# EAGLE design G826X (EAGLE 6.6.0)
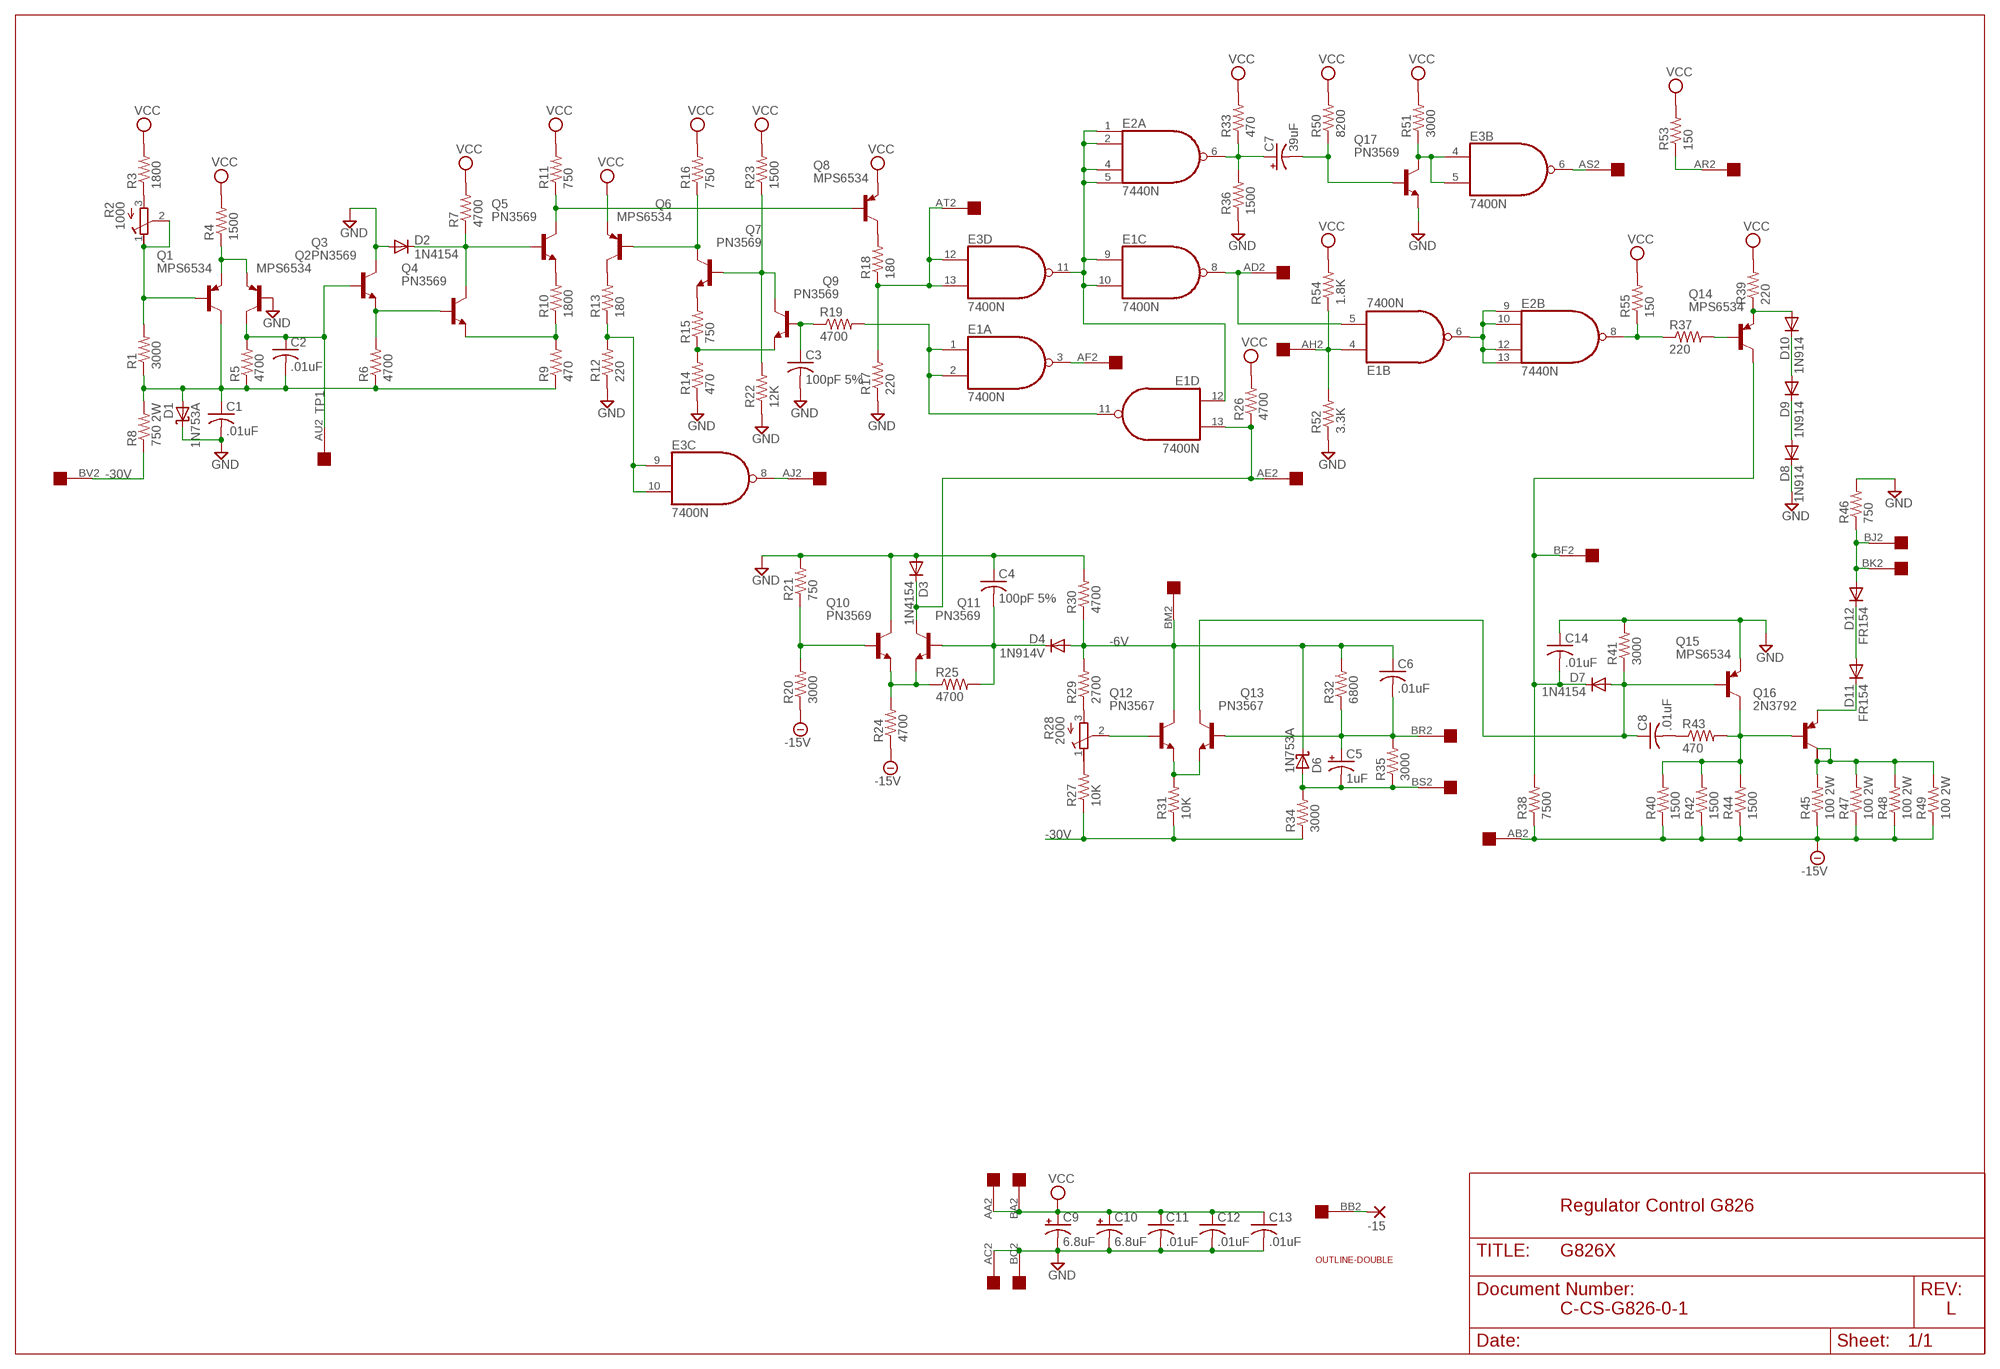
[diagram p0: schematic, sheet 1]

## Parts
-15  1,6/0,8  [1,6/0,8]
C1  .01uF  C-US050-025X075  [C050-025X075]
C2  .01uF  C-US050-025X075  [C050-025X075]
C3  100pF 5%  C-US050-025X075  [C050-025X075]
C4  100pF 5%  C-US050-025X075  [C050-025X075]
C5  1uF  CPOL-USE15-5AXIAL  [E15-5]
C6  .01uF  C-US050-025X075  [C050-025X075]
C7  39uF  CPOL-USE22-6AXIAL  [E22-6]
C8  .01uF  C-US050-025X075  [C050-025X075]
C9  6.8uF  CPOL-USE20-8AXIAL  [E12-8]
C10  6.8uF  CPOL-USE20-8AXIAL  [E12-8]
C11  .01uF  C-US050-025X075  [C050-025X075]
C12  .01uF  C-US050-025X075  [C050-025X075]
C13  .01uF  C-US050-025X075  [C050-025X075]
C14  .01uF  C-US050-025X075  [C050-025X075]
D1  1N753A  BAT42  [DO35-10]
D2  1N4154  1N4148  [DO35-10]
D3  1N4154  1N4148  [DO35-10]
D4  1N914V  1N4148  [DO35-10]
D6  1N753A  BAT42  [DO35-10]
D7  1N4154  1N4148  [DO35-10]
D8  1N914  1N4148  [DO35-10]
D9  1N914  1N4148  [DO35-10]
D10  1N914  1N4148  [DO35-10]
D11  FR154  1N4004  [DO41-10]
D12  FR154  1N4004  [DO41-10]
E1  7400N  [DIL14]
E2  7440N  74S20N  [DIL14]
E3  7400N  [DIL14]
Q1  MPS6534  2N2904  [TO39]
Q2  MPS6534  2N2904  [TO39]
Q3  PN3569  2N2219  [TO5]
Q4  PN3569  2N2219  [TO5]
Q5  PN3569  2N2219  [TO5]
Q6  MPS6534  2N2904  [TO39]
Q7  PN3569  2N2219  [TO5]
Q8  MPS6534  2N2904  [TO39]
Q9  PN3569  2N2219  [TO5]
Q10  PN3569  2N2219  [TO5]
Q11  PN3569  2N2219  [TO5]
Q12  PN3567  2N2219  [TO5]
Q13  PN3567  2N2219  [TO5]
Q14  MPS6534  2N2904  [TO39]
Q15  MPS6534  2N2904  [TO39]
Q16  2N3792  2N4902  [TO3]
Q17  PN3569  2N2219  [TO5]
R1  3000  R-US_0207/10  [0207/10]
R2  1000  275P  [3006Y]
R3  1800  R-US_0207/10  [0207/10]
R4  1500  R-US_0207/10  [0207/10]
R5  4700  R-US_0207/10  [0207/10]
R6  4700  R-US_0207/10  [0207/10]
R7  4700  R-US_0207/10  [0207/10]
R8  750 2W  R-US_0818/25  [0818/25]
R9  470  R-US_0207/10  [0207/10]
R10  1800  R-US_0207/10  [0207/10]
R11  750  R-US_0207/10  [0207/10]
R12  220  R-US_0207/10  [0207/10]
R13  180  R-US_0207/10  [0207/10]
R14  470  R-US_0207/10  [0207/10]
R15  750  R-US_0207/10  [0207/10]
R16  750  R-US_0207/10  [0207/10]
R17  220  R-US_0207/10  [0207/10]
R18  180  R-US_0207/10  [0207/10]
R19  4700  R-US_0207/10  [0207/10]
R20  3000  R-US_0207/10  [0207/10]
R21  750  R-US_0207/10  [0207/10]
R22  12K  R-US_0207/10  [0207/10]
R23  1500  R-US_0207/10  [0207/10]
R24  4700  R-US_0207/10  [0207/10]
R25  4700  R-US_0207/10  [0207/10]
R26  4700  R-US_0207/10  [0207/10]
R27  10K  R-US_0207/10  [0207/10]
R28  2000  275P  [3006Y]
R29  2700  R-US_0207/10  [0207/10]
R30  4700  R-US_0207/10  [0207/10]
R31  10K  R-US_0207/10  [0207/10]
R32  6800  R-US_0207/10  [0207/10]
R33  470  R-US_0207/10  [0207/10]
R34  3000  R-US_0207/10  [0207/10]
R35  3000  R-US_0207/10  [0207/10]
R36  1500  R-US_0207/10  [0207/10]
R37  220  R-US_0207/10  [0207/10]
R38  7500  R-US_0207/10  [0207/10]
R39  220  R-US_0207/10  [0207/10]
R40  1500  R-US_0207/10  [0207/10]
R41  3000  R-US_0207/10  [0207/10]
R42  1500  R-US_0207/10  [0207/10]
R43  470  R-US_0207/10  [0207/10]
R44  1500  R-US_0207/10  [0207/10]
R45  100 2W  R-US_0818/25  [0818/25]
R46  750  R-US_0207/10  [0207/10]
R47  100 2W  R-US_0818/25  [0818/25]
R48  100 2W  R-US_0818/25  [0818/25]
R49  100 2W  R-US_0818/25  [0818/25]
R50  8200  R-US_0207/10  [0207/10]
R51  3000  R-US_0207/10  [0207/10]
R52  3.3K  R-US_0207/10  [0207/10]
R53  150  R-US_0207/10  [0207/10]
R54  1.8K  R-US_0207/10  [0207/10]
R55  150  R-US_0207/10  [0207/10]
U$1  DOUBLE  [EDGE-CON4]
U$2  OUTLINE-DOUBLE  [DOUBLE]

## Nets
-6V: C6.1 D4.A D6.C Q12.3(C) R29.2 R30.1 R32.2 U$1.BM2
-15V: R20.1 R24.1 R38.1 R40.1 R42.1 R44.1 R45.1 R47.1 R48.1 R49.1 U$1.AB2
-30V: R8.1 R27.1 R31.1 R34.1 U$1.BV2
GND: C1.2 C3.2 C4.1 C9.- C10.- C11.2 C12.2 C13.2 C14.1 D1.C D2.A D3.A D8.C Q2.2(B) Q3.3(C) Q10.3(C) Q15.1(E) Q17.1(E) R12.1 R14.1 R17.1 R21.2 R22.1 R30.2 R36.1 R41.2 R46.2 R52.1 U$1.AC2 U$1.BC2
N$1: Q1.2(B) R1.2 R2.1(A) R2.2(S)
N$2: R2.3(E) R3.1
N$3: C1.1 C2.2 D1.A Q1.3(C) R1.1 R5.1 R6.1 R8.2 R9.1
N$4: Q1.1(E) Q2.1(E) R4.1
N$5: Q3.1(E) Q4.2(B) R6.2
N$6: Q4.1(E) R9.2 R10.1
N$7: D2.C Q4.3(C) Q5.2(B) R7.1
N$8: Q5.3(C) Q8.2(B) R11.1
N$9: Q5.1(E) R10.2
N$10: E3.9(C:I0) E3.10(C:I1) R12.2 R13.1
N$11: Q6.3(C) R13.2
N$12: E3.8(C:O) U$1.AJ2
N$13: Q6.2(B) Q7.3(C) R16.1
N$14: Q7.1(E) R15.2
N$15: Q9.1(E) R14.2 R15.1
N$16: Q7.2(B) Q9.3(C) R22.2 R23.1
N$17: Q8.3(C) R18.2
N$18: E3.12(D:I0) E3.13(D:I1) R17.2 R18.1 U$1.AT2
N$19: E1.9(C:I0) E1.10(C:I1) E1.12(D:I0) E2.1(A:I0) E2.2(A:I1) E2.4(A:I2) E2.5(A:I3) E3.11(D:O)
N$20: C3.1 Q9.2(B) R19.1
N$21: E1.1(A:I0) E1.2(A:I1) E1.11(D:O) R19.2
N$22: E1.3(A:O) U$1.AF2
N$23: E1.5(B:I1) E1.8(C:O) U$1.AD2
N$24: E1.6(B:O) E2.9(B:I0) E2.10(B:I1) E2.12(B:I2) E2.13(B:I3)
N$25: C7.+ E2.6(A:O) R33.1 R36.2
N$26: Q16.C Q16.C/ R45.2 R47.2 R48.2 R49.2
N$27: Q15.3(C) Q16.B R40.2 R42.2 R43.2 R44.2
N$28: C7.- Q17.2(B) R50.1
N$29: E3.4(B:I0) E3.5(B:I1) Q17.3(C) R51.1
N$30: E3.6(B:O) U$1.AS2
N$31: E1.4(B:I0) R52.2 R54.1 U$1.AH2
N$32: E2.8(B:O) R37.1 R55.1
N$33: R53.1 U$1.AR2
N$34: Q14.2(B) R37.2
N$35: D10.A Q14.1(E) R39.1
N$36: D8.A D9.C
N$37: D9.A D10.C
N$38: C14.2 D7.C Q14.3(C) R38.2 U$1.BF2
N$39: -15.1(P) U$1.BB2
N$40: Q10.2(B) R20.2 R21.1
N$41: Q10.1(E) Q11.1(E) R24.2 R25.1
N$42: D3.C E1.13(D:I1) Q11.3(C) R26.1 U$1.AE2
N$43: Q12.2(B) R28.2(S)
N$44: C4.2 D4.C Q11.2(B) R25.2
N$45: Q12.1(E) Q13.1(E) R31.2
N$46: C5.- D6.A R34.2 R35.1 U$1.BS2
N$47: R28.3(E) R29.1
N$48: R27.2 R28.1(A)
N$49: D11.C Q16.E
N$50: C5.+ C6.2 Q13.2(B) R32.1 R35.2 U$1.BR2
N$51: C8.1 D7.A Q13.3(C) Q15.2(B) R41.1
N$52: C8.2 R43.1
N$53: D11.A D12.C
N$54: D12.A R46.1 U$1.BJ2 U$1.BK2
TP1: C2.1 Q2.3(C) Q3.2(B) R5.2 U$1.AU2
VCC: C9.+ C10.+ C11.1 C12.1 C13.1 Q6.1(E) Q8.1(E) R3.2 R4.2 R7.2 R11.2 R16.2 R23.2 R26.2 R33.2 R39.2 R50.2 R51.2 R53.2 R54.2 R55.2 U$1.AA2 U$1.BA2
Unconnected: E3.1(A:I0) E3.2(A:I1) E3.3(A:O) U$1.AA1 U$1.AB1 U$1.AC1 U$1.AD1 U$1.AE1 U$1.AF1 U$1.AH1 U$1.AJ1 U$1.AK1 U$1.AK2 U$1.AL1 U$1.AL2 U$1.AM1 U$1.AM2 U$1.AN1 U$1.AN2 U$1.AP1 U$1.AP2 U$1.AR1 U$1.AS1 U$1.AT1 U$1.AU1 U$1.AV1 U$1.AV2 U$1.BA1 U$1.BB1 U$1.BC1 U$1.BD1 U$1.BD2 U$1.BE1 U$1.BE2 U$1.BF1 U$1.BH1 U$1.BH2 U$1.BJ1 U$1.BK1 U$1.BL1 U$1.BL2 U$1.BM1 U$1.BN1 U$1.BN2 U$1.BP1 U$1.BP2 U$1.BR1 U$1.BS1 U$1.BT1 U$1.BT2 U$1.BU1 U$1.BU2 U$1.BV1

## Notes on the sheet
- Regulator Control G826
- C-CS-G826-0-1 | L

## Power pins joined to a net without a drawn wire
GND: E1.7(P:GND) E2.7(P:GND) E3.7(P:GND)
VCC: E1.14(P:VCC) E2.14(P:VCC) E3.14(P:VCC)

## Library data of the parts
-15 = wirepad:1,6/0,8: THROUGH-HOLE PAD
C1-C4 C6 C8 C11-C14 = rcl:C-US: CAPACITOR, American symbol
C5 C7 = rcl:CPOL-US: POLARIZED CAPACITOR, American symbol
C9 C10 = dec-con:CPOL-USE20-8AXIAL: A 0.8 inch electrolytic.
D1 D6 = diode:BAT42: DIODE barrier diode
D2-D4 D7-D10 = diode:1N4148: DIODE high speed (Philips)
D11 D12 = diode:1N4004: DIODE general purpose rectifier, 1 A
E1 E3 = 74xx-us:74*00: Quad 2-input NAND gate
E2 = 74xx-us:74*20: Dual 4-input NAND gate
Q1 Q2 Q6 Q8 Q14 Q15 = transistor-pnp:2N2904*: PNP Transistror
Q3-Q5 Q7 Q9-Q13 Q17 = transistor-npn:2N2219: NPN Transistor
Q16 = transistor-pnp:2N4902: PNP Transistor
R1 R3-R7 R9-R27 R29-R44 R46 R50-R55 = rcl:R-US_: RESISTOR, American symbol
R2 R28 = dec-con:275P: Trimpot with 275P (3006Y) footprint.
R8 R45 R47-R49 = dec-con:R-US_0818/25: One inch resistor
U$1 = dec-con:DOUBLE: Double-Height DEC board
U$2 = dec-con:OUTLINE-*: Board outlines for DEC boards.

## Board
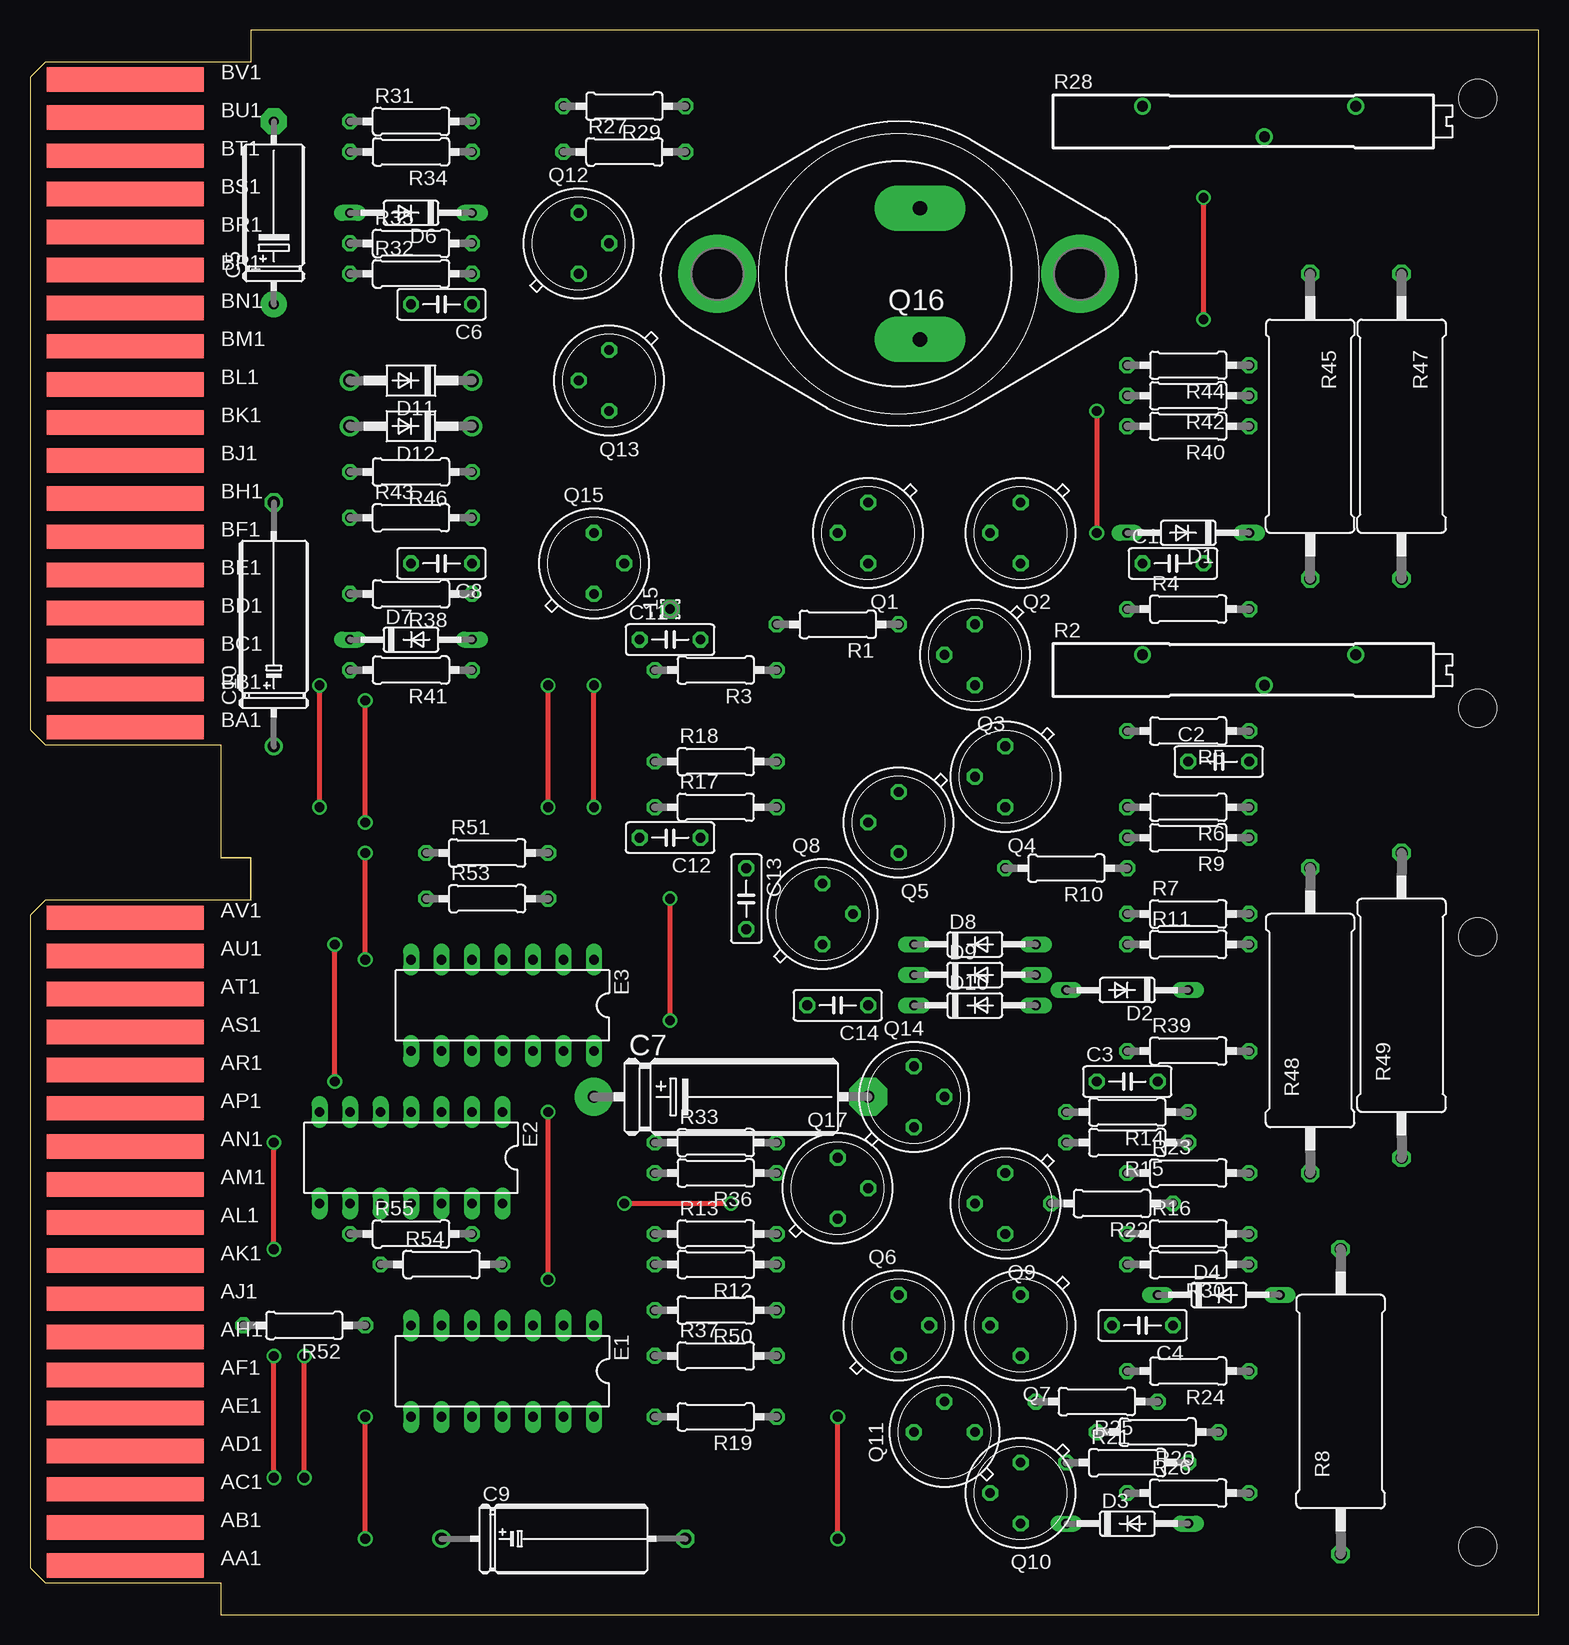
[diagram p1: board, top side]
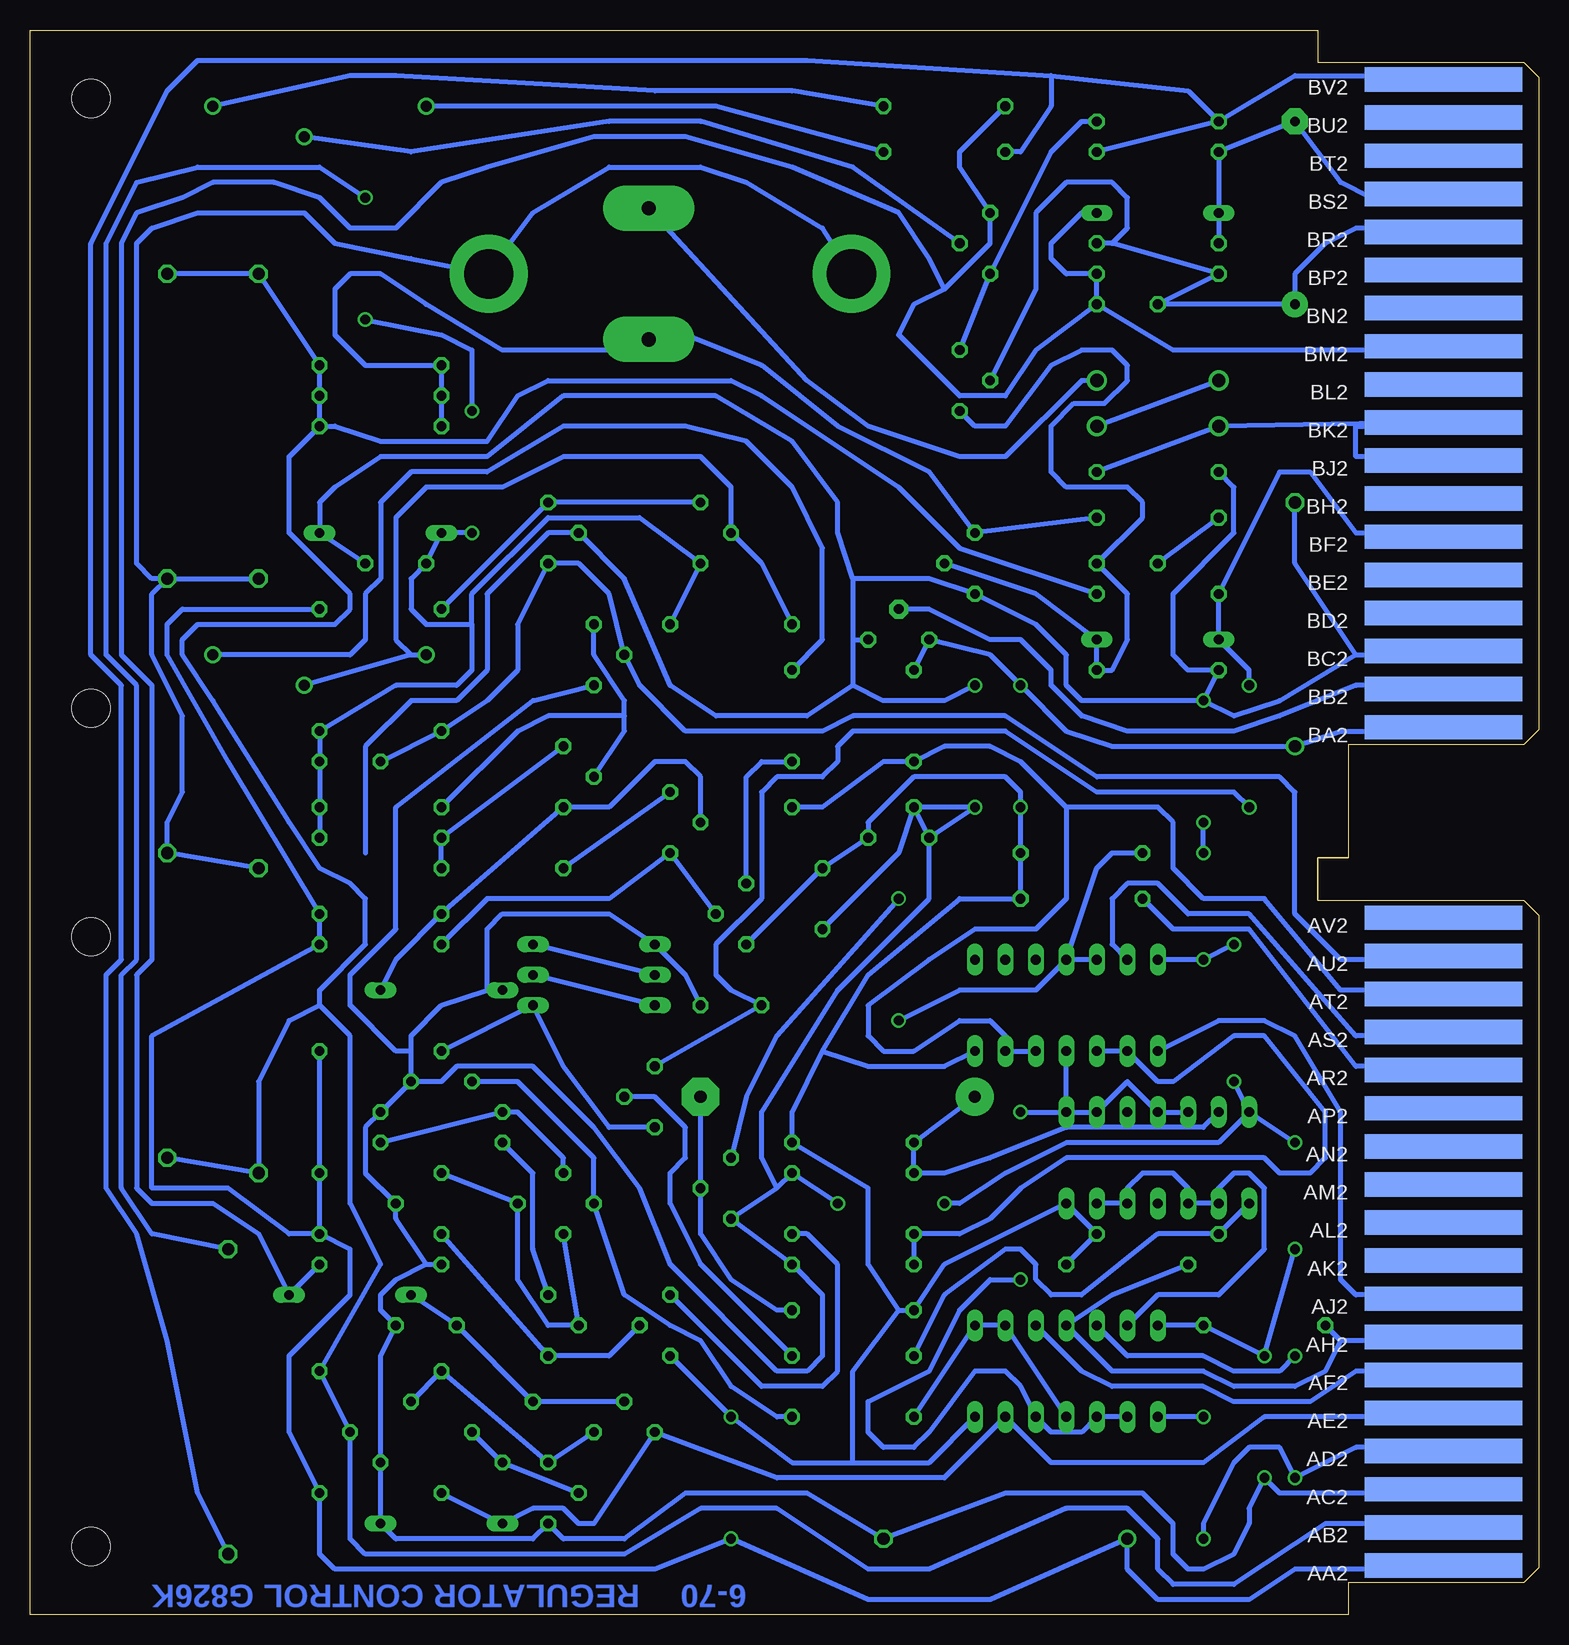
[diagram p2: board, bottom side, seen from below]

Size 125.73 x 132.08 mm. Coordinates in mm from the lower left corner, seen from the top.
Copper layers (1+16): Top 0.035mm / dielectric 1.5mm / Bottom 0.035mm
Design rules "16mils": minimum track width 16mil, minimum drill 32mil, track to track 15mil, track to pad 10mil, pad to pad 10mil, via to via 10mil, smd to smd 10mil, copper to edge 13mil, drill to drill 10mil, minimum pad ring 10mil, minimum via ring 8mil, stop-mask expansion 0mil, vias tented up to drill 0mil, thermal gap 10mil

### Footprints (pad centres in the part's own frame; a part is rotated, then mirrored left to right if it is on the bottom)
1,6/0,8 = drill 0.813 pad 1.6 octagon: 1 0,0
C050-025X075 = drill 0.813 octagon: 1 -2.54,0; 2 2.54,0
E15-5 = drill 0.813 pad 2.159: + -7.62,0 | drill 0.813 pad 2.159 octagon: - 7.62,0
E22-6 = drill 1.016 pad 3.15: + -11.43,0 | drill 1.016 pad 3.15 octagon: - 11.43,0
E12-8 = drill 1.016: + -10.16,0 | drill 1.016 octagon: - 10.16,0
DO35-10 = drill 0.813 long: A 5.08,0; C -5.08,0
DO41-10 = drill 1.118: A 5.08,0; C -5.08,0
DIL14 = drill 0.813 long: 1 -7.62,-3.81; 2 -5.08,-3.81; 3 -2.54,-3.81; 4 0,-3.81; 5 2.54,-3.81; 6 5.08,-3.81; 7 7.62,-3.81; 8 7.62,3.81; 9 5.08,3.81; 10 2.54,3.81; 11 0,3.81; 12 -2.54,3.81; 13 -5.08,3.81; 14 -7.62,3.81
TO39 = drill 0.813 octagon: 1 0,-2.54; 2 2.54,0; 3 0,2.54
TO5 = drill 0.813 octagon: 1 0,-2.54; 2 2.54,0; 3 0,2.54
TO3 = drill 1.194 pad 3.81 long: B -1.778,5.461; E -1.778,-5.461 | drill 4.115 pad 6.477: C 15.113,0; C/ -15.113,0
0207/10 = drill 0.813 octagon: 1 -5.08,0; 2 5.08,0
3006Y = drill 0.9: 1 -8.89,1.27; 2 1.27,-1.27; 3 8.89,1.27
0818/25 = drill 1.016 octagon: 1 -12.7,0; 2 12.7,0
EDGE-CON4 = smd 13.106 x 2.032: AA1 7.938,4.128; AB1 7.938,7.303; AC1 7.938,10.477; AD1 7.938,13.652; AE1 7.938,16.828; AF1 7.938,20.003; AH1 7.938,23.177; AJ1 7.938,26.352; AK1 7.938,29.527; AL1 7.938,32.703; AM1 7.938,35.877; AN1 7.938,39.053; AP1 7.938,42.227; AR1 7.938,45.403; AS1 7.938,48.578; AT1 7.938,51.752; AU1 7.938,54.928; AV1 7.938,58.102; BA1 7.938,73.978; BB1 7.938,77.153; BC1 7.938,80.328; BD1 7.938,83.502; BE1 7.938,86.677; BF1 7.938,89.853; BH1 7.938,93.028; BJ1 7.938,96.203; BK1 7.938,99.377; BL1 7.938,102.552; BM1 7.938,105.728; BN1 7.938,108.903; BP1 7.938,112.078; BR1 7.938,115.252; BS1 7.938,118.427; BT1 7.938,121.603; BU1 7.938,124.778; BV1 7.938,127.953 | smd 13.106 x 2.032 bottom: AA2 7.938,4.128; AB2 7.938,7.303; AC2 7.938,10.477; AD2 7.938,13.652; AE2 7.938,16.828; AF2 7.938,20.003; AH2 7.938,23.177; AJ2 7.938,26.352; AK2 7.938,29.527; AL2 7.938,32.703; AM2 7.938,35.877; AN2 7.938,39.053; AP2 7.938,42.227; AR2 7.938,45.403; AS2 7.938,48.578; AT2 7.938,51.752; AU2 7.938,54.928; AV2 7.938,58.102; BA2 7.938,73.978; BB2 7.938,77.153; BC2 7.938,80.328; BD2 7.938,83.502; BE2 7.938,86.677; BF2 7.938,89.853; BH2 7.938,93.028; BJ2 7.938,96.203; BK2 7.938,99.377; BL2 7.938,102.552; BM2 7.938,105.728; BN2 7.938,108.903; BP2 7.938,112.078; BR2 7.938,115.252; BS2 7.938,118.427; BT2 7.938,121.603; BU2 7.938,124.778; BV2 7.938,127.953
DOUBLE = hole 3.175: 120.65,56.515; 120.65,5.715; 120.65,75.565; 120.65,126.365

### Placement (x,y rotation side)
-15  53.34,83.82 90 top
C1  95.25,87.63 0 top
C2  99.06,71.12 0 top
C3  91.44,44.45 0 top
C4  92.71,24.13 180 top
C5  20.32,116.84 90 top
C6  34.29,109.22 180 top
C7  58.42,43.18 0 top
C8  34.29,87.63 180 top
C9  44.45,6.35 0 top
C10  20.32,82.55 90 top
C11  53.34,81.28 0 top
C12  53.34,64.77 180 top
C13  59.69,59.69 270 top
C14  67.31,50.8 180 top
D1  96.52,90.17 180 top
D2  91.44,52.07 180 top
D3  91.44,7.62 0 top
D4  99.06,26.67 0 top
D6  31.75,116.84 180 top
D7  31.75,81.28 0 top
D8  78.74,55.88 0 top
D9  78.74,53.34 0 top
D10  78.74,50.8 0 top
D11  31.75,102.87 180 top
D12  31.75,99.06 180 top
E1  39.37,20.32 180 top
E2  31.75,38.1 180 top
E3  39.37,50.8 180 top
Q1  69.85,90.17 180 top
Q2  82.55,90.17 180 top
Q3  78.74,80.01 180 top
Q4  81.28,69.85 180 top
Q5  72.39,66.04 180 top
Q6  72.39,24.13 0 top
Q7  82.55,24.13 180 top
Q8  66.04,58.42 0 top
Q9  81.28,34.29 180 top
Q10  82.55,10.16 180 top
Q11  76.2,15.24 90 top
Q12  45.72,114.3 0 top
Q13  48.26,102.87 180 top
Q14  73.66,43.18 0 top
Q15  46.99,87.63 0 top
Q16  72.39,111.76 180 top
Q17  67.31,35.56 0 top
R1  67.31,82.55 180 top
R2  101.6,78.74 0 top
R3  57.15,78.74 180 top
R4  96.52,83.82 0 top
R5  96.52,73.66 180 top
R6  96.52,67.31 180 top
R7  96.52,58.42 0 top
R8  109.22,17.78 90 top
R9  96.52,64.77 180 top
R10  86.36,62.23 180 top
R11  96.52,55.88 0 top
R12  57.15,29.21 180 top
R13  57.15,31.75 0 top
R14  91.44,41.91 180 top
R15  91.44,39.37 180 top
R16  96.52,31.75 0 top
R17  57.15,67.31 0 top
R18  57.15,71.12 0 top
R19  57.15,16.51 180 top
R20  93.98,15.24 180 top
R21  91.44,12.7 0 top
R22  90.17,34.29 180 top
R23  96.52,36.83 0 top
R24  96.52,20.32 180 top
R25  88.9,17.78 180 top
R26  96.52,10.16 0 top
R27  49.53,121.92 0 top
R28  101.6,124.46 0 top
R29  49.53,125.73 180 top
R30  96.52,29.21 180 top
R31  31.75,124.46 0 top
R32  31.75,111.76 0 top
R33  57.15,39.37 0 top
R34  31.75,121.92 180 top
R35  31.75,114.3 0 top
R36  57.15,36.83 180 top
R37  57.15,21.59 0 top
R38  31.75,85.09 180 top
R39  96.52,46.99 0 top
R40  96.52,99.06 180 top
R41  31.75,78.74 180 top
R42  96.52,101.6 180 top
R43  31.75,91.44 0 top
R44  96.52,104.14 180 top
R45  106.68,99.06 270 top
R46  31.75,95.25 180 top
R47  114.3,99.06 270 top
R48  106.68,49.53 90 top
R49  114.3,50.8 90 top
R50  57.15,25.4 180 top
R51  38.1,63.5 0 top
R52  22.86,24.13 180 top
R53  38.1,59.69 0 top
R54  34.29,29.21 0 top
R55  31.75,31.75 0 top
U$1  0,0 0 top
U$2  0,0 0 top

### Tracks (layer width: path | path; a pad name or v marks a point on that pad's centre or on a via)
-6V
  Bottom 0.406: R29.2 48.26,121.92 48.26,120.65 Q12.3 45.72,114.3 49.53,110.49 | U$1.BM2 8.89,105.41 30.48,105.41 C6.1 | C6.1 R32.2 39.37,111.76 40.64,113.03 40.64,114.3 38.1,116.84 D6.C | 49.53,110.49 52.07,109.22 53.34,106.68 48.26,101.6 44.45,101.6 41.91,105.41 C6.1 | 49.53,110.49 50.8,113.03 53.34,116.84 62.23,120.65 71.12,123.19 78.74,123.19 87.63,120.65 91.44,119.38 95.25,115.57 99.06,115.57 101.6,118.11 105.41,119.38 110.49,119.38 113.03,118.11 116.84,116.84 118.11,114.3 118.11,80.01 115.57,77.47 115.57,54.61 116.84,53.34 116.84,35.56 115.57,34.29 110.49,34.29 106.68,31.75 D4.A R30.1
-15V
  Bottom 0.406: U$1.AB2 8.89,7.62 17.78,7.62 25.4,2.54 30.48,2.54 31.75,3.81 31.75,6.35 34.29,8.89 39.37,8.89 50.8,3.81 55.88,3.81 63.5,8.89 69.85,8.89 76.2,5.08 97.79,5.08 99.06,6.35 R20.1 R24.1 96.52,29.21 99.06,34.29 99.06,48.26 101.6,50.8 | R47.1 R45.1 R44.1 R42.1 R40.1 | R49.1 R48.1 106.68,44.45 104.14,49.53 101.6,50.8 | R38.1 48.26,88.9 53.34,93.98 64.77,101.6 67.31,102.87 82.55,102.87 85.09,101.6 87.63,97.79 96.52,97.79 100.33,99.06 R40.1 | R40.1 104.14,96.52 104.14,90.17 99.06,85.09 99.06,83.82 100.33,82.55 111.76,82.55 113.03,81.28 113.03,80.01 110.49,76.2 104.14,66.04 101.6,62.23 99.06,60.96 97.79,59.69 97.79,55.88 101.6,52.07 101.6,50.8
-30V
  Bottom 0.406: U$1.BV2 8.89,128.27 20.32,128.27 R31.1 | R31.1 R34.1 | R27.1 43.18,121.92 40.64,125.73 40.64,128.27 | 40.64,128.27 29.21,127 R31.1 | 40.64,128.27 60.96,129.54 111.76,129.54 114.3,127 120.65,114.3 120.65,80.01 118.11,77.47 118.11,54.61 119.38,53.34 119.38,35.56 116.84,31.75 114.3,22.86 111.76,10.16 R8.1
GND  (via drill 0.81)
  Top 0.406: v22.86,11.43 v22.86,21.59 | v20.32,30.48 v20.32,39.37 | v27.94,66.04 v27.94,76.2 | v27.94,54.61 v27.94,63.5 | v25.4,44.45 v25.4,55.88 | v49.53,34.29 v58.42,34.29 | v46.99,67.31 v46.99,77.47
  Bottom 0.406: U$1.AC2 8.89,10.16 21.59,10.16 v22.86,11.43 24.13,8.89 24.13,7.62 25.4,5.08 27.94,3.81 29.21,3.81 30.48,5.08 30.48,7.62 33.02,10.16 44.45,10.16 C9.- 60.96,10.16 71.12,10.16 76.2,6.35 81.28,6.35 Q10.3 83.82,6.35 95.25,6.35 D3.A R21.2 96.52,21.59 C4.1 96.52,25.4 96.52,26.67 95.25,27.94 92.71,29.21 | E1.7 R52.1 v22.86,21.59 v20.32,30.48 | v20.32,39.37 E2.7 | v27.94,76.2 R41.2 29.21,78.74 30.48,80.01 30.48,85.09 25.4,90.17 25.4,93.98 R46.2 | v27.94,63.5 v27.94,66.04 | E3.7 v27.94,54.61 v25.4,55.88 | E2.7 v25.4,44.45 | U$1.BC2 8.89,80.01 15.24,80.01 | 15.24,80.01 20.32,87.63 C10.- | 15.24,80.01 21.59,76.2 25.4,74.93 v27.94,76.2 | E2.7 26.67,39.37 39.37,39.37 44.45,36.83 48.26,34.29 v49.53,34.29 | v58.42,34.29 R36.1 63.5,35.56 | 63.5,35.56 Q17.1 R12.1 59.69,26.67 59.69,21.59 60.96,20.32 63.5,20.32 72.39,29.21 74.93,35.56 78.74,40.64 83.82,45.72 90.17,45.72 91.44,44.45 C3.2 | 63.5,35.56 64.77,38.1 64.77,41.91 58.42,52.07 50.8,59.69 C12.2 | C12.2 v46.99,67.31 R17.1 | C12.2 R17.1 | v27.94,76.2 38.1,76.2 39.37,77.47 39.37,80.01 41.91,82.55 Q15.1 50.8,86.36 57.15,86.36 | 57.15,86.36 57.15,81.28 | 57.15,81.28 57.15,77.47 | 57.15,77.47 54.61,76.2 49.53,76.2 v46.99,77.47 | 57.15,81.28 C11.2 | C12.2 R17.1 | R17.1 53.34,63.5 C13.2 | C1.2 D1.C 101.6,92.71 100.33,93.98 96.52,96.52 87.63,96.52 81.28,101.6 68.58,101.6 62.23,97.79 58.42,92.71 58.42,90.17 57.15,86.36 | C14.1 71.12,53.34 D8.C 77.47,58.42 86.36,58.42 87.63,57.15 87.63,52.07 | 87.63,52.07 91.44,50.8 93.98,48.26 93.98,46.99 | 87.63,52.07 D2.A | C3.2 93.98,46.99 | 57.15,77.47 60.96,74.93 68.58,74.93 72.39,77.47 76.2,86.36 Q2.2 82.55,90.17 87.63,85.09 87.63,78.74 90.17,76.2 93.98,76.2 97.79,72.39 97.79,63.5
  Bottom 0.406: Q3.3 83.82,76.2 95.25,67.31 95.25,57.15 99.06,53.34 99.06,50.8 95.25,46.99 93.98,46.99 | C3.2 R14.1 97.79,40.64 97.79,36.83 R22.1 95.25,33.02 92.71,29.21 | 92.71,29.21 R30.2
N$1
  Bottom 0.406: 93.98,80.01 R2.1 | 93.98,80.01 R2.2 | R1.2 64.77,87.63 Q1.2 67.31,93.98 69.85,96.52 81.28,96.52 86.36,93.98 92.71,93.98 95.25,91.44 95.25,81.28 93.98,80.01
N$2
  Bottom 0.406: R3.1 59.69,81.28 59.69,88.9 62.23,93.98 66.04,97.79 71.12,99.06 81.28,99.06 87.63,95.25 93.98,95.25 96.52,92.71 96.52,86.36 97.79,85.09 97.79,81.28 99.06,80.01 R2.3
N$3  (via drill 0.81)
  Top 0.406: v97.79,118.11 v97.79,107.95 | v88.9,100.33 v88.9,90.17
  Bottom 0.406: R8.2 115.57,31.75 118.11,35.56 118.11,53.34 116.84,54.61 116.84,77.47 119.38,80.01 119.38,114.3 116.84,119.38 111.76,120.65 101.6,120.65 v97.79,118.11 | v97.79,107.95 91.44,106.68 88.9,105.41 v88.9,100.33 | v88.9,90.17 D1.A C1.1 93.98,86.36 93.98,83.82 92.71,82.55 88.9,82.55 | R1.1 Q1.3 74.93,91.44 82.55,91.44 88.9,85.09 88.9,82.55 | 88.9,82.55 88.9,78.74 90.17,77.47 95.25,77.47 R5.1 C2.2 R6.1 R9.1
N$4
  Bottom 0.406: Q1.1 Q2.1 R4.1
N$5
  Bottom 0.406: Q4.2 76.2,73.66 76.2,74.93 | 76.2,74.93 76.2,76.2 78.74,80.01 Q3.1 | R6.2 85.09,73.66 82.55,74.93 76.2,74.93
N$6
  Bottom 0.406: Q4.1 R9.2 R10.1
N$7
  Bottom 0.406: Q5.2 69.85,69.85 71.12,71.12 73.66,71.12 77.47,67.31 Q4.3 R7.1 95.25,54.61 D2.C
N$8
  Bottom 0.406: Q8.2 Q5.3 77.47,59.69 87.63,59.69 R11.1
N$9
  Bottom 0.406: Q5.1 R10.2
N$10
  Bottom 0.406: E3.10 E3.9 31.75,44.45 30.48,44.45 25.4,48.26 22.86,48.26 17.78,41.91 17.78,38.1 19.05,36.83 21.59,36.83 22.86,38.1 39.37,38.1 43.18,35.56 45.72,33.02 48.26,31.75 R13.1 R12.2
N$11
  Bottom 0.406: R13.2 60.96,31.75 58.42,29.21 58.42,20.32 59.69,19.05 64.77,19.05 Q6.3
N$12
  Bottom 0.406: U$1.AJ2 8.89,26.67 15.24,26.67 16.51,27.94 16.51,41.91 20.32,48.26 22.86,49.53 26.67,49.53 E3.8
N$13
  Bottom 0.406: Q6.2 77.47,21.59 Q7.3 R16.1
N$14
  Bottom 0.406: R15.2 83.82,36.83 83.82,30.48 Q7.1
N$15
  Bottom 0.406: Q9.1 81.28,38.1 85.09,41.91 R14.2 R15.1
N$16
  Bottom 0.406: Q9.3 Q7.2 82.55,24.13 85.09,27.94 R22.2 R23.1
N$17
  Bottom 0.406: R18.2 64.77,71.12 66.04,69.85 Q8.3
N$18
  Bottom 0.406: E3.12 E3.13 44.45,48.26 45.72,49.53 48.26,49.53 52.07,46.99 54.61,46.99 55.88,48.26 55.88,50.8 50.8,54.61 46.99,57.15 41.91,57.15 39.37,59.69 39.37,67.31 | 39.37,67.31 31.75,67.31 30.48,66.04 30.48,62.23 27.94,59.69 22.86,59.69 16.51,52.07 8.89,52.07 U$1.AT2 | 39.37,67.31 43.18,71.12 45.72,72.39 49.53,72.39 R18.1 54.61,71.12 59.69,67.31 R17.2
N$19  (via drill 0.81)
  Top 0.406: v43.18,27.94 v43.18,41.91
  Bottom 0.406: E2.1 E3.11 | v43.18,41.91 E2.1 | E2.5 E2.4 34.29,44.45 E2.2 E2.1 | v43.18,27.94 45.72,27.94 48.26,25.4 50.8,20.32 55.88,17.78 55.88,15.24 54.61,13.97 52.07,13.97 50.8,15.24 46.99,20.32 44.45,20.32 43.18,19.05 E1.12 40.64,15.24 38.1,15.24 E1.10 E1.9
N$20
  Bottom 0.406: R19.1 63.5,16.51 67.31,19.05 69.85,22.86 72.39,24.13 76.2,26.67 Q9.2 78.74,38.1 85.09,44.45 C3.1
N$21
  Bottom 0.406: E1.11 E1.2 E1.1 R19.2
N$22
  Bottom 0.406: E1.3 38.1,20.32 35.56,19.05 27.94,19.05 25.4,17.78 19.05,17.78 15.24,20.32 8.89,20.32 U$1.AF2
N$23  (via drill 0.81)
  Top 0.406: v20.32,11.43 v20.32,21.59 | v27.94,6.35 v27.94,16.51
  Bottom 0.406: U$1.AD2 8.89,13.97 15.24,13.97 v20.32,11.43 21.59,13.97 24.13,13.97 25.4,12.7 27.94,7.62 v27.94,6.35 | E1.5 34.29,21.59 27.94,21.59 25.4,20.32 21.59,20.32 v20.32,21.59 | v27.94,16.51 E1.8
N$24
  Bottom 0.406: E2.13 E2.12 34.29,35.56 33.02,36.83 30.48,36.83 29.21,35.56 E2.10 E2.9 26.67,35.56 25.4,36.83 24.13,36.83 22.86,35.56 22.86,30.48 26.67,26.67 31.75,26.67 E1.6
N$25
  Bottom 0.406: E2.6 27.94,40.64 39.37,40.64 45.72,38.1 49.53,36.83 R36.2 R33.1 C7.+
N$26
  Bottom 0.406: Q16.C 59.69,115.57 66.04,119.38 69.85,120.65 77.47,120.65 83.82,116.84 87.63,111.76 Q16.C/ 93.98,113.03 100.33,114.3 102.87,116.84 111.76,116.84 115.57,115.57 116.84,114.3 116.84,87.63 115.57,86.36 R47.2 | R47.2 R45.2 | R48.2 R49.2 114.3,66.04 113.03,68.58 113.03,74.93 115.57,80.01 115.57,85.09 R47.2
N$27
  Bottom 0.406: R43.2 Q15.3 50.8,95.25 58.42,99.06 64.77,104.14 71.12,106.68 Q16.B 76.2,105.41 86.36,105.41 92.71,109.22 96.52,111.76 99.06,111.76 100.33,110.49 100.33,106.68 97.79,104.14 R44.2 R42.2 R40.2
N$28
  Bottom 0.406: C7.- Q17.2 69.85,31.75 67.31,27.94 63.5,25.4 R50.1
N$29  (via drill 0.81)
  Top 0.406: v53.34,49.53 v53.34,59.69
  Bottom 0.406: E3.5 E3.4 | E3.4 36.83,62.23 35.56,63.5 R51.1 | E3.4 41.91,52.07 48.26,52.07 v53.34,49.53 | Q17.3 66.04,43.18 63.5,48.26 v53.34,59.69
N$30
  Bottom 0.406: U$1.AS2 8.89,48.26 15.24,48.26 24.13,58.42 29.21,58.42 31.75,60.96 34.29,60.96 35.56,59.69 35.56,55.88 E3.6
N$31
  Bottom 0.406: U$1.AH2 8.89,22.86 16.51,22.86 | 16.51,22.86 R52.2 | 16.51,22.86 17.78,20.32 20.32,19.05 25.4,19.05 27.94,20.32 35.56,20.32 E1.4 35.56,26.67 R54.1
N$32
  Bottom 0.406: E2.8 R55.1 31.75,31.75 38.1,26.67 40.64,26.67 41.91,27.94 41.91,29.21 43.18,30.48 44.45,30.48 49.53,26.67 R37.1
N$33
  Bottom 0.406: U$1.AR2 8.89,45.72 15.24,45.72 24.13,57.15 30.48,57.15 R53.1
N$34
  Bottom 0.406: R37.2 69.85,29.21 72.39,34.29 72.39,36.83 71.12,38.1 71.12,40.64 73.66,43.18 Q14.2
N$35
  Bottom 0.406: Q14.1 77.47,40.64 81.28,45.72 D10.A R39.1
N$36
  Bottom 0.406: D9.C D8.A
N$37
  Bottom 0.406: D10.C D9.A
N$38  (via drill 0.81)
  Top 0.406: v24.13,67.31 v24.13,77.47
  Bottom 0.406: U$1.BF2 8.89,90.17 15.24,90.17 19.05,95.25 21.59,95.25 R38.2 D7.C 24.13,78.74 v24.13,77.47 | v24.13,67.31 25.4,68.58 36.83,68.58 44.45,73.66 57.15,73.66 58.42,72.39 58.42,71.12 59.69,69.85 63.5,69.85 64.77,68.58 64.77,59.69 68.58,55.88 68.58,53.34 67.31,52.07 C14.2 Q14.3
N$39
  Bottom 0.406: U$1.BB2 8.89,77.47 15.24,77.47 21.59,74.93 25.4,73.66 34.29,73.66 38.1,74.93 40.64,77.47 40.64,78.74 43.18,81.28 45.72,81.28 50.8,83.82 -15.1
N$40
  Bottom 0.406: R20.2 R21.1 Q10.2
N$41
  Bottom 0.406: Q11.1 Q10.1 R24.2 R25.1
N$42
  Bottom 0.406: R26.1 D3.C 83.82,8.89 81.28,8.89 80.01,7.62 78.74,7.62 Q11.3 63.5,11.43 49.53,11.43 E1.13 40.64,12.7 27.94,12.7 22.86,16.51 8.89,16.51 U$1.AE2
N$43
  Bottom 0.406: R28.2 93.98,121.92 77.47,124.46 69.85,124.46 57.15,120.65 Q12.2
N$44
  Bottom 0.406: Q11.2 R25.2 C4.2 D4.C
N$45
  Bottom 0.406: R31.2 38.1,124.46 40.64,121.92 Q12.1 Q13.1
N$46
  Bottom 0.406: U$1.BS2 8.89,118.11 13.97,118.11 16.51,119.38 C5.- R34.2 D6.A R35.1
N$47
  Bottom 0.406: R28.3 99.06,128.27 95.25,128.27 73.66,127 62.23,127 R29.1
N$48
  Bottom 0.406: R28.1 68.58,125.73 R27.2
N$49
  Bottom 0.406: Q16.E 60.96,102.87 55.88,99.06 48.26,96.52 44.45,96.52 38.1,102.87 D11.C
N$50
  Bottom 0.406: Q13.2 41.91,110.49 41.91,116.84 39.37,119.38 35.56,119.38 34.29,118.11 34.29,115.57 35.56,114.3 | 35.56,114.3 R32.1 C6.2 C5.+ 20.32,111.76 17.78,114.3 15.24,115.57 8.89,115.57 U$1.BR2 | 35.56,114.3 R35.2
N$51
  Bottom 0.406: Q13.3 46.99,99.06 44.45,99.06 40.64,104.14 38.1,105.41 35.56,105.41 34.29,104.14 34.29,102.87 36.2,100.97 38.74,100.97 40.64,99.06 40.64,95.25 39.37,93.98 34.29,93.98 33.02,92.71 33.02,91.44 C8.1 34.29,85.09 34.29,81.28 35.56,78.74 R41.1 D7.A 41.91,85.09 Q15.2
N$52
  Bottom 0.406: R43.1 C8.2
N$53
  Bottom 0.406: D11.A D12.C
N$54
  Bottom 0.406: U$1.BJ2 8.89,96.52 15.24,96.52 15.24,99.06 8.89,99.06 U$1.BK2 D12.A R46.1
TP1
  Bottom 0.406: U$1.AU2 8.89,54.61 16.51,54.61 20.32,58.42 20.32,68.58 21.59,69.85 36.83,69.85 44.45,74.93 57.15,74.93 59.69,73.66 71.12,73.66 74.93,77.47 Q3.2 77.47,85.09 80.01,87.63 Q2.3 85.09,82.55 85.09,78.74 87.63,76.2 R5.2 C2.1
VCC  (via drill 0.81)
  Top 0.406: v67.31,6.35 v67.31,16.51 | v43.18,67.31 v43.18,77.47
  Bottom 0.406: U$1.AA2 8.89,3.81 20.32,3.81 24.13,1.27 31.75,1.27 34.29,3.81 C9.+ 45.72,1.27 55.88,1.27 v67.31,6.35 73.66,3.81 100.33,3.81 101.6,5.08 R26.2 104.14,15.24 104.14,21.59 99.06,26.67 99.06,30.48 R16.2 | E1.14 50.8,12.7 57.15,12.7 | 57.15,12.7 62.23,12.7 v67.31,16.51 Q6.1 | 57.15,12.7 57.15,20.32 53.34,25.4 | 53.34,25.4 R50.2 49.53,29.21 E2.14 R55.2 R54.2 | 53.34,25.4 55.88,29.21 55.88,35.56 R33.2 62.23,41.91 59.69,46.99 | 59.69,46.99 55.88,45.72 49.53,45.72 E3.14 | 59.69,46.99 55.88,53.34 48.26,59.69 R53.2 R51.2 v43.18,67.31 43.18,68.58 44.45,69.85 52.07,69.85 55.88,66.04 C12.1 C13.1 Q8.1 | U$1.BA2 8.89,73.66 16.51,73.66 C10.+ 35.56,72.39 39.37,73.66 v43.18,77.47 45.72,80.01 C11.1 R3.2 | R16.2 R23.2 R39.2 | R16.2 104.14,31.75 109.22,35.56 115.57,35.56 115.57,48.26 R11.2 R7.2 109.22,71.12 114.3,80.01 114.3,82.55 113.03,83.82 R4.2

### Text on the board
Bottom: 6-70 | REGULATOR CONTROL G826K